# EAGLE design wardrobe_closer (EAGLE 9.6.2)
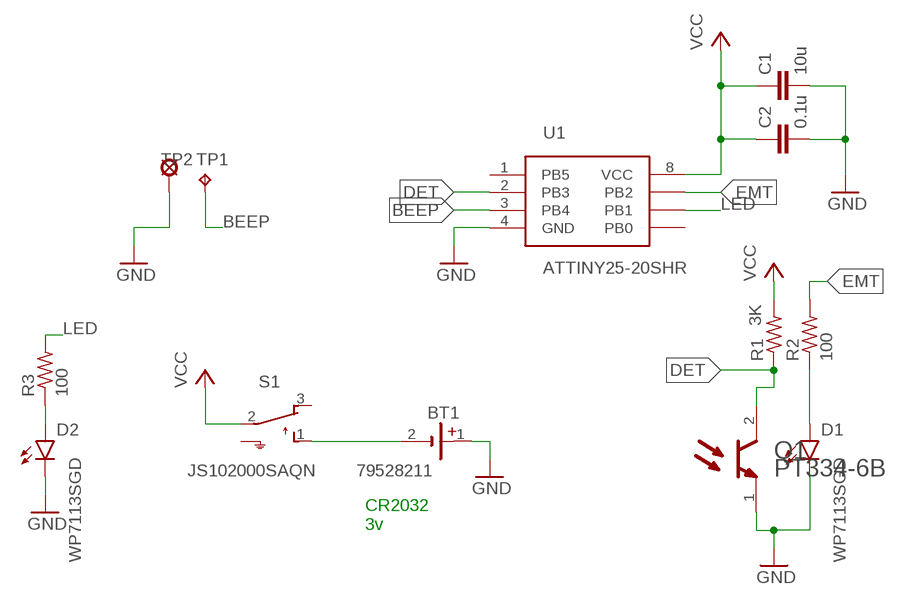
[diagram p0: schematic, sheet 1]

## Parts
BT1  79528211  [79528211]
C1  10u  C-EUC0603K  [C0603K]
C2  0.1u  C-EUC0603K  [C0603K]
D1  WP7113SGD  [RADIAL_5MM]
D2  WP7113SGD  [RADIAL_5MM]
Q1  EVERLIGHT_PT334-6BEVERLIGHT_PT334-6B_0_0  [EVERLIGHT_PT334-6B_0]
R1  3K  R-US_R0603  [R0603]
R2  100  R-US_R0603  [R0603]
R3  100  R-US_R0603  [R0603]
S1  JS102000SAQN  [JS102000SAQN]
TP1  TPB1,27  [B1,27]
TP2  LSP10  [LSP10]
U1  ATTINY25-20SHR  ATTINY85-20SU  [SOIC-8]

## Nets
BEEP: TP1.TP U1.3(PB4)
DET: Q1.2(COLLECTOR) R1.1 U1.2(PB3)
EMT: R2.2 U1.7(PB2)
GND: BT1.1(+) C1.2 C2.2 D1.C D2.C Q1.1(EMITTER) TP2.MP U1.4(GND)
LED: R3.2 U1.6(PB1)
N$1: D1.A R2.1
N$2: BT1.2(-) S1.1
N$7: D2.A R3.1
VCC: C1.1 C2.1 R1.2 S1.2 U1.8(VCC)
Unconnected: S1.3 S1.S1(SH) S1.S2(SH) U1.1(PB5) U1.5(PB0)

## Notes on the sheet
- CR2032
  3v

## Library data of the parts
BT1 = Battery Holder:79528211: BATTERY HOLDER COIN 20MM PC PIN Manufacturer's datasheet <https://katalog.we-online.de/em/datasheet/79528211.pdf>; CREATED_BY: PCBLayout.com; DIGIKEY_PART_NO: 732-12326-ND; MANUFACTURER: Wurth Electronics Inc.; MPN: 79528211
C1 C2 = rcl:C-EU: CAPACITOR, European symbol; SPICEPREFIX: C
D1 D2 = LED:WP7113SGD: LED GREEN DIFFUSED T-1 3/4 T/H Manufacturer's datasheet <http://www.kingbrightusa.com/images/catalog/SPEC/WP7113SGD.pdf>; CREATED_BY: PCBLayout.com; DIGIKEY_PART_NUMBER: 754-1735-ND; MANUFACTURER: Kingbright; MPN: WP7113SGD; PACKAGE: RADIAL 5MM
Q1 = Everlight - PT334-6B:EVERLIGHT_PT334-6B: 5mm Phototransistor; CENTROID_NOT_SPECIFIED: No; DATASHEET: https://media.digikey.com/pdf/Data%20Sheets/Everlight%20PDFs/PT334-6B.pdf; DIGIKEY_DESCRIPTION: TRANS PHOTOTRANSISTOR 5MM BLACK RAD; DIGIKEY_PART_NUMBER: 1080-1158-ND; IPC_LAND_PATTERN_NAME: CAPRD254W75D590H860; LEAD_FREE: yes; MF: Everlight; MOUSER_PART_NUMBER: 638-PT3346B; MPN: PT334-6B; PACKAGE: RADIAL; PREFIX: Q; ROHS: yes; TEMPERATURE_RANGE_HIGH: +85°C; TEMPERATURE_RANGE_LOW: -25°C
R1-R3 = resistor:R-US_: RESISTOR, American symbol
S1 = Switch:JS102000SAQN: SWITCH SLIDE SPDT 1MA 5V Manufacturer's datasheet <https://www.ckswitches.com/media/1422/js.pdf>; CREATED_BY: PCBLayout.com; DIGIKEY_PARTNO: 401-2005-2-ND; MANUFACTURER: C&K; MPN: JS102000SAQN
TP1 = BeagleBone_Blue_R3:TP: Test pad
TP2 = solpad:LSP10: SOLDER PAD drill 1.0 mm, distributor Buerklin, 12H555
U1 = Microcontroller:ATTINY85-20SU: IC MCU 8BIT 8KB FLASH 8SOIC Manufacturer's datasheet <http://ww1.microchip.com/downloads/en/DeviceDoc/Atmel-2586-AVR-8-bit-Microcontroller-ATtiny25-ATtiny45-ATtiny85_Datasheet-Summary.pdf>; CREATED_BY: PCBLayout.com; DIGI_KEY_PART_NUMBER: ATTINY85-20SU-ND; MANUFACTURER: Microchip Technology; MPN: ATTINY85-20SU; PACKAGE: 8-SOIC

## Board
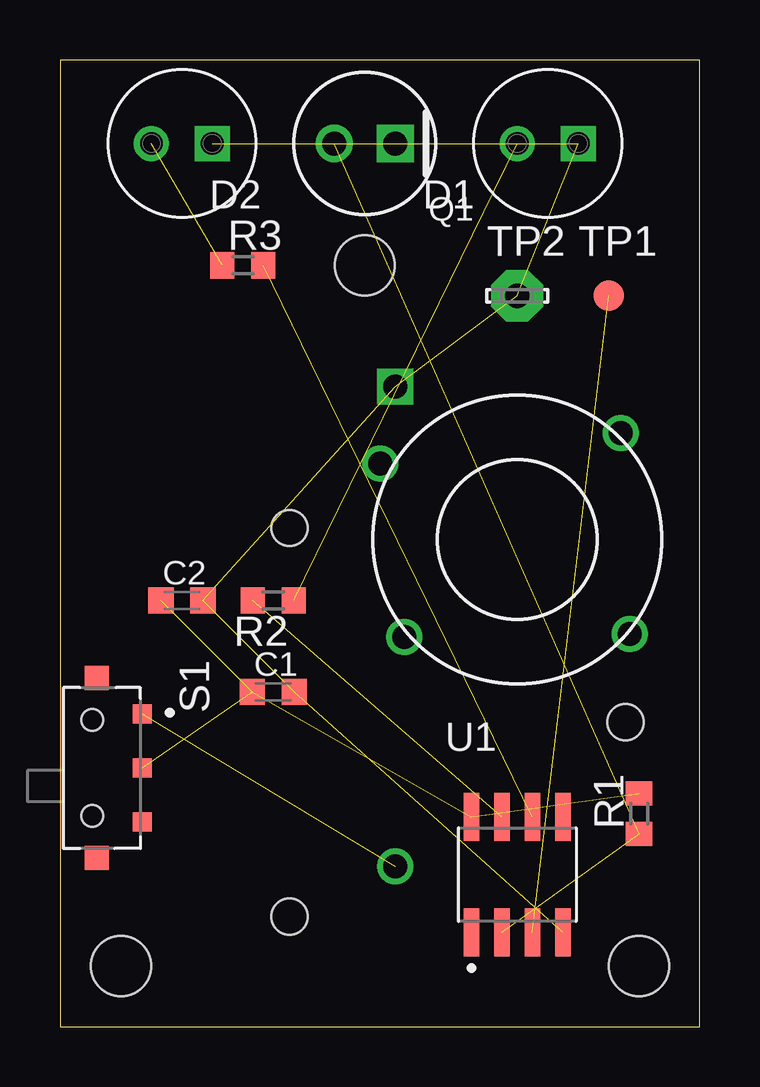
[diagram p1: board, top side]
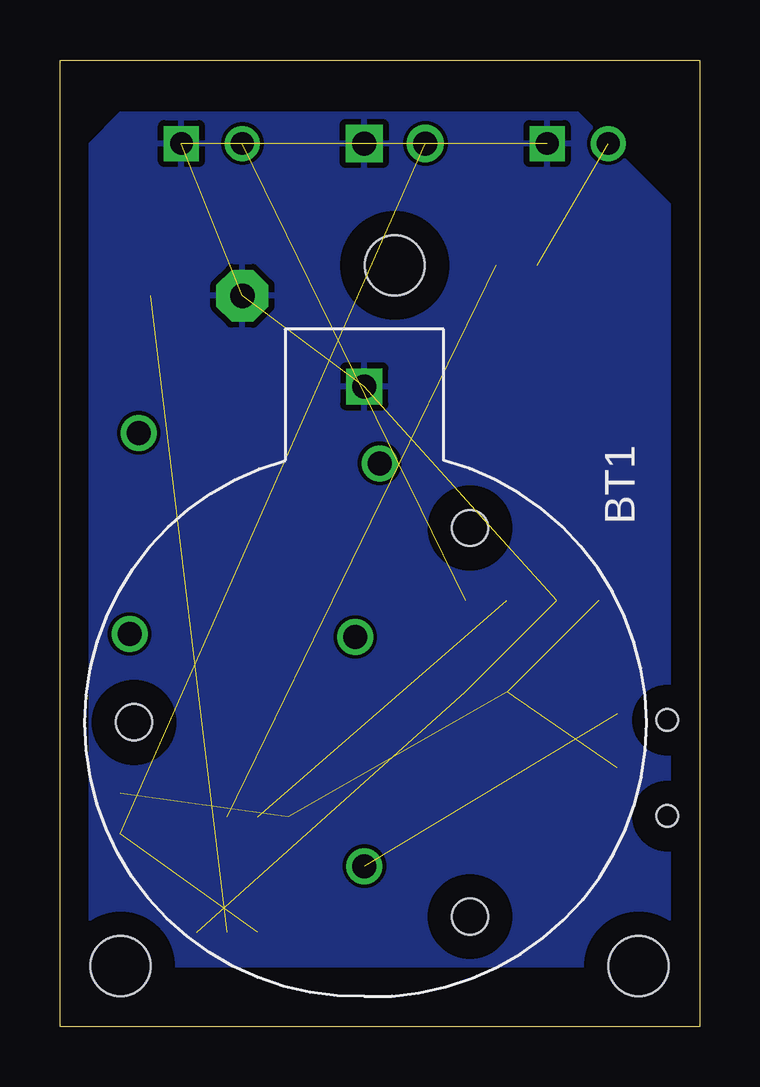
[diagram p2: board, bottom side, seen from below]

Size 26.65 x 40.31 mm. Coordinates in mm from the lower left corner, seen from the top.
Outline: 0,0 26.65,0 26.65,40.31 0,40.31 0,0
Copper layers (1*16): Top 0.035mm / dielectric 1.5mm / Bottom 0.035mm
Design rules "default": minimum track width 6mil, minimum drill 0.35mm, track to track 6mil, track to pad 6mil, pad to pad 6mil, via to via 6mil, smd to smd 6mil, copper to edge 40mil, drill to drill 6mil, minimum pad ring 10mil, minimum via ring 8mil, stop-mask expansion 4mil, vias tented up to drill 0mil, thermal gap 10mil
Holes 2.5 mm at 2.54,2.54 24.13,2.54 12.7,31.75

### Footprints (pad centres in the part's own frame; a part is rotated, then mirrored left to right if it is on the bottom)
79528211 = drill 1 square: 1 -14,0 | drill 1: 2 6,0 | hole 1.5: -8.1,4.4; 8.1,4.4; 0,-9.6
C0603K = smd 1.05 x 1.08: 1 -0.875,0; 2 0.875,0
RADIAL_5MM = drill 0.95 pad 1.43: A 1.27,0 | drill 0.95 pad 1.43 square: C -1.27,0
EVERLIGHT_PT334-6B_0 = drill 1 pad 1.55 square: 1 -1.27,0 | drill 1 pad 1.55: 2 1.27,0
R0603 = smd 1 x 1.1: 1 -0.85,0; 2 0.85,0
JS102000SAQN = smd 0.8 x 0.8: 1 -2.25,1.9; 2 0,1.9; 3 2.25,1.9 | smd 1 x 1: S1 -3.75,0; S2 3.75,0 | hole 0.9: 2,-0.18; -2,-0.18
B1,27 = smd 1.27 x 1.27: TP 0,0
LSP10 = drill 1.016 pad 2.159 octagon: MP 0,0
SOIC-8 = smd 0.66 x 2: 1 -1.905,-2.405; 2 -0.635,-2.405; 3 0.635,-2.405; 4 1.905,-2.405; 5 1.905,2.405; 6 0.635,2.405; 7 -0.635,2.405; 8 -1.905,2.405

### Placement (x,y rotation side)
BT1  13.97,12.7 270 bottom
C1  8.89,13.97 0 top
C2  5.08,17.78 0 top
D1  20.32,36.83 180 top
D2  5.08,36.83 180 top
Q1  12.7,36.83 180 top
R1  24.13,8.89 90 top
R2  8.89,17.78 180 top
R3  7.62,31.75 0 top
S1  1.52,10.79 270 top
TP1  22.86,30.48 0 top
TP2  19.05,30.48 0 top
U1  19.05,6.35 0 top

### Tracks (layer width: path | path; a pad name or v marks a point on that pad's centre or on a via)
BEEP  (1 unrouted)
DET  (2 unrouted)
EMT  (1 unrouted)
GND  (7 unrouted)
  pour Bottom: 1.27,34.29 5.08,38.1 24.13,38.1 25.4,36.83 25.4,34.29 25.4,3.81 24.13,2.54 2.54,2.54 1.27,3.81
LED  (1 unrouted)
N$1  (1 unrouted)
N$2  (1 unrouted)
N$3  (via drill 1)
  other vias: 23.37,24.77
N$4  (via drill 1)
  other vias: 23.75,16.38
N$5  (via drill 1)
  other vias: 14.35,16.26
N$6  (via drill 1)
  other vias: 13.34,23.5
N$7  (1 unrouted)
VCC  (4 unrouted)